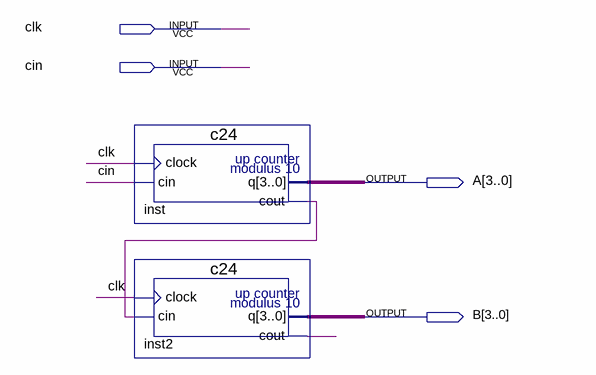
[diagram p0: schematic sheet]
// Quartus schematic p5.bdf as structural Verilog: 2 symbols, 4 pins
module p5 (
  input  clk,
  input  cin,
  output [3:0] A,
  output [3:0] B
);

  wire inst2_cout, inst_cout;

  c24 inst (.clock(clk), .cin(cin), .cout(inst_cout), .q(A));
  c24 inst2 (.clock(clk), .cin(inst_cout), .cout(inst2_cout), .q(B));
endmodule
